# Altium project EVMOMAPL137_Orcad_revg.PrjPcb (part 4 of 4)
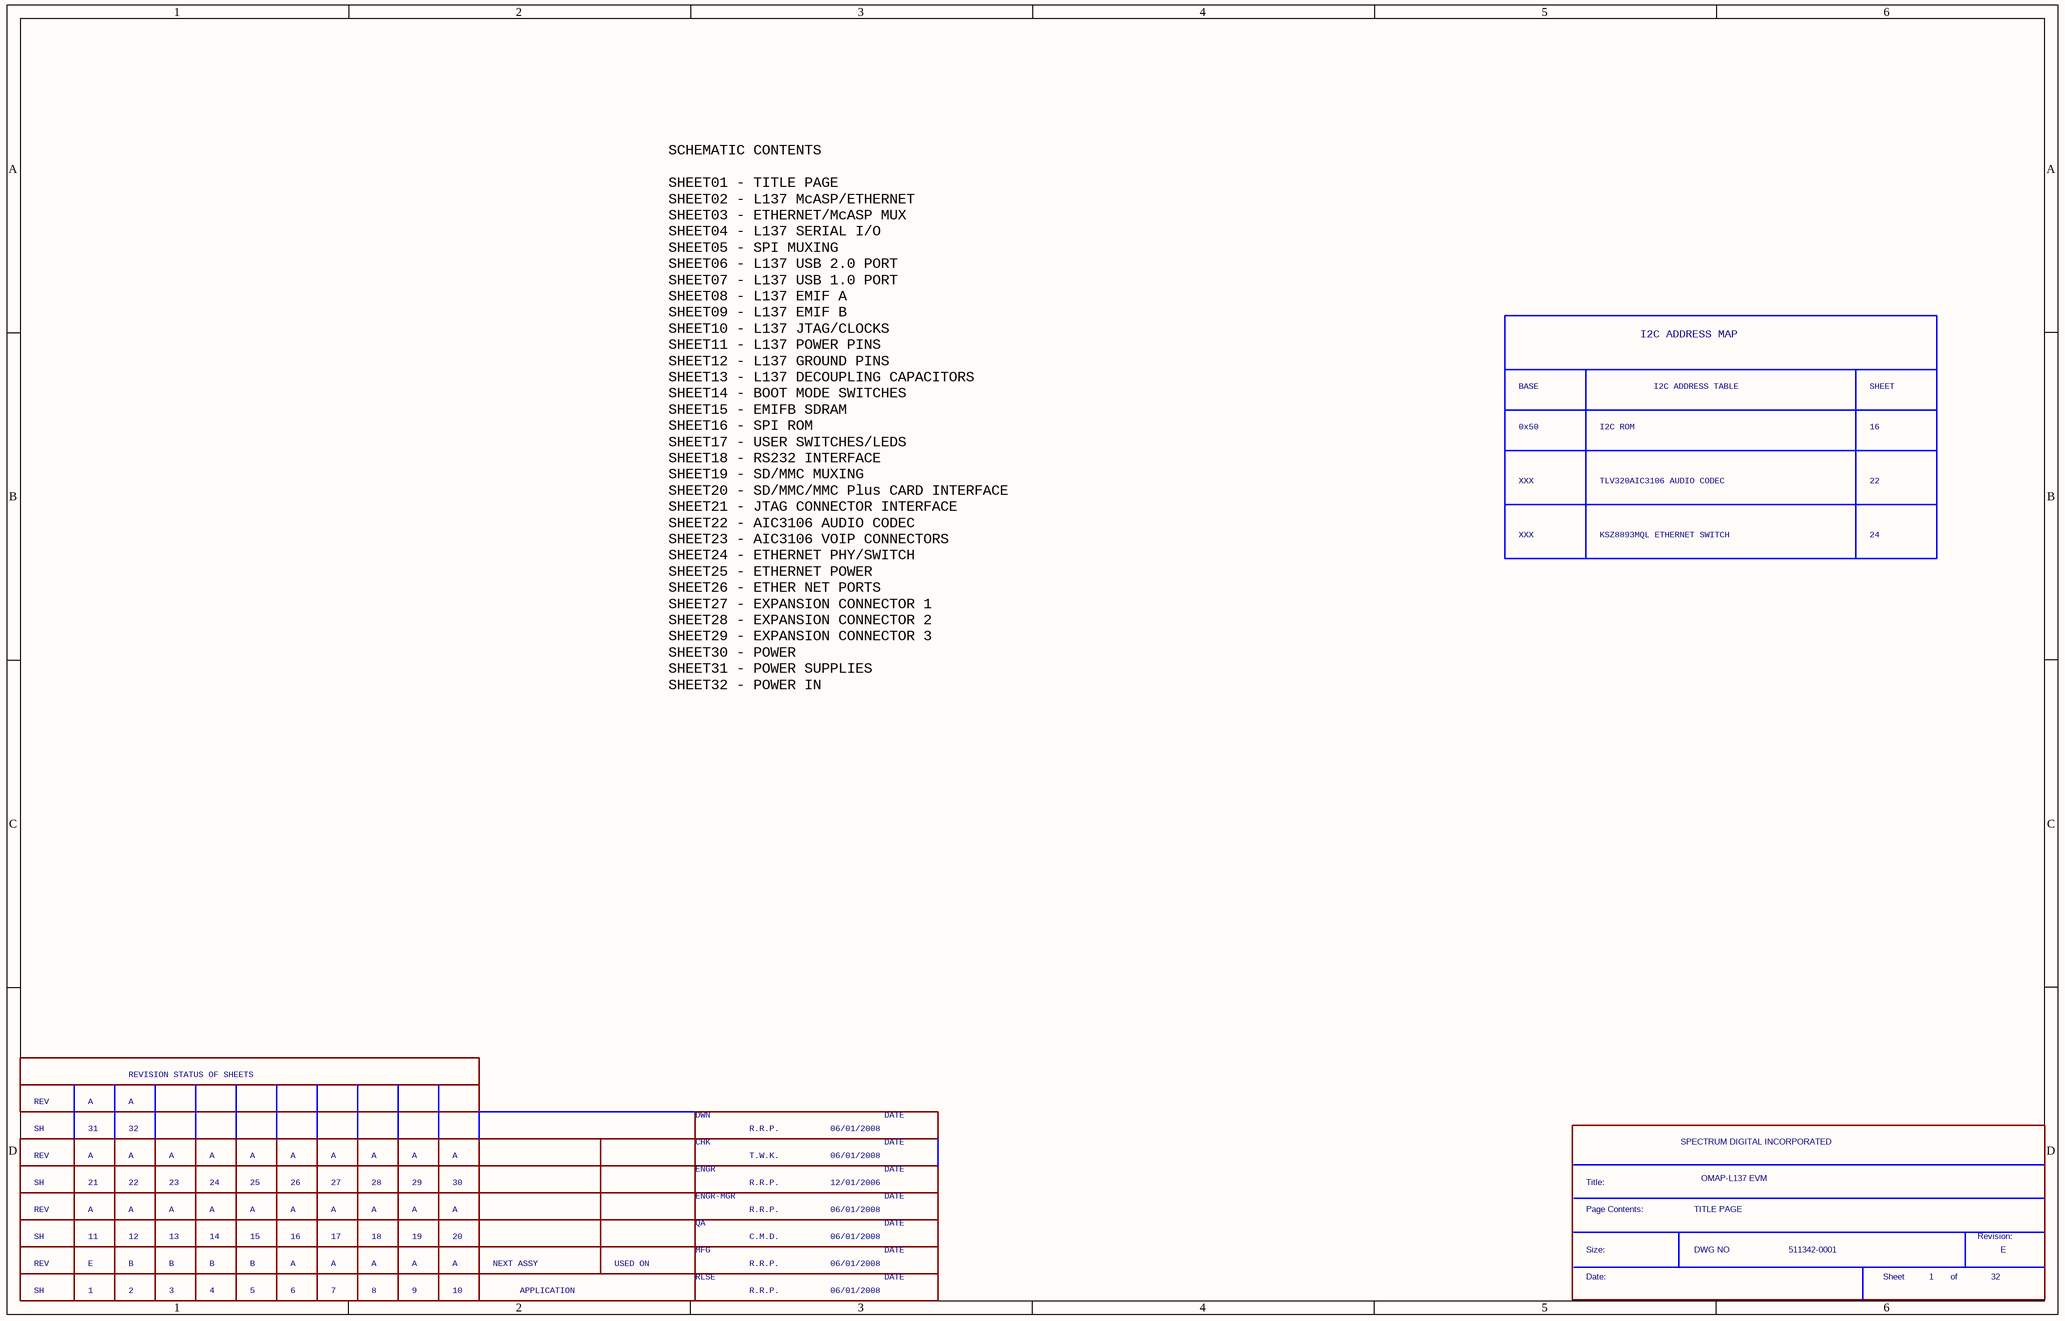
[diagram p32: SH01 - TITLE PAGE.SchDoc]

## Nets that join several sheets
ALT_3V3: SH31 - POWER II (22 pins), SH30 - POWER (6 pins)
ALT_CPU_1V2: SH32 - POWER INPUT (5 pins), SH11 - OMAP-L137 POWER (PTP3.2 PTP4.2 R118.2 R119.1)
CPU_1V2: SH31 - POWER II (R347.1), SH30 - POWER (R313.2 TP20.1), SH11 - OMAP-L137 POWER (7 pins)
CPU_1V8: SH30 - POWER (R323.2 TP26.1), SH07 - OMAP-L137 USB1 (PTP10.2 R64.2), SH06 - OMAP-L137 USB2 (PTP8.2 R57.2)
CPU_3V3: SH30 - POWER (R316.2 TP22.1), SH11 - OMAP-L137 POWER (PTP1.2 R115.2), SH07 - OMAP-L137 USB1 (PTP9.2 R63.2), SH06 - OMAP-L137 USB2 (PTP7.2 R55.2)
CPU_RTC_1V8: SH30 - POWER (C242.1 TP28.1 U44.20), SH10 - OMAP-L137 JTAG (R100.1)
CVDD: SH13 - OMAP-L137 CAPS (19 pins), SH11 - OMAP-L137 POWER (20 pins)
DSK_1V8: SH31 - POWER II (R350.1), SH30 - POWER (R318.2 TP24.1)
DSK_3V3: SH31 - POWER II (R355.1), SH30 - POWER (R312.2 TP18.1), SH27 - EXPANSION1 (C233.1 U43.5), SH26 - ENET PORTS (P9.9 P9.11 P10.9 P10.11), SH25 - ENET- POWER (9 pins), SH24 - ENET PHY (25 pins), SH22 - AIC3106 (13 pins), SH21 - JTAG CONNECTOR (19 pins), SH20 - SD_MMC (18 pins), SH19 - SD_MMC MUX (7 pins), SH18 -  RS232 (5 pins), SH17 - USER SWITCHES_LE (8 pins), SH16 - SPI ROM (19 pins), SH15 - SDRAM EMIF B (32 pins), SH14 - BOOT MODE (15 pins), SH10 - OMAP-L137 JTAG (5 pins), SH09 - OMAP-L137 EMIF B (10 pins), SH08 - OMAP-L137 EMIF A (C39.1 R65.1 U15.5), SH07 - OMAP-L137 USB1 (R61.1), SH06 - OMAP-L137 USB2 (5 pins), SH04 - OMAP-L137 SERIAL (9 pins), SH03 - ETHERNET MUXES (7 pins), SH02 - OMAP-L137 MCASP (8 pins)
DVDD: SH13 - OMAP-L137 CAPS (26 pins), SH11 - OMAP-L137 POWER (23 pins)
ENET_VDDATR: SH26 - ENET PORTS (6 pins), SH25 - ENET- POWER (6 pins)
GND: SH32 - POWER INPUT (18 pins), SH31 - POWER II (26 pins), SH30 - POWER (32 pins), SH29 - EXPANSION3 (23 pins), SH28 - EXPANSION2 (10 pins), SH27 - EXPANSION1 (26 pins), SH26 - ENET PORTS (8 pins), SH25 - ENET- POWER (47 pins), SH24 - ENET PHY (28 pins), SH23 - AIC PHONE AIC (13 pins), SH22 - AIC3106 (45 pins), SH21 - JTAG CONNECTOR (33 pins), SH20 - SD_MMC (13 pins), SH19 - SD_MMC MUX (13 pins), SH18 -  RS232 (9 pins), SH17 - USER SWITCHES_LE (RN24.1 RN24.2 RN24.3 RN24.4), SH16 - SPI ROM (15 pins), SH15 - SDRAM EMIF B (32 pins), SH14 - BOOT MODE (9 pins), SH13 - OMAP-L137 CAPS (45 pins), SH12 - OMAP-L137 GND (32 pins), SH11 - OMAP-L137 POWER (7 pins), SH10 - OMAP-L137 JTAG (15 pins), SH08 - OMAP-L137 EMIF A (28 pins), SH07 - OMAP-L137 USB1 (23 pins), SH06 - OMAP-L137 USB2 (31 pins), SH05 - SPI MUXING (8 pins), SH04 - OMAP-L137 SERIAL (13 pins), SH03 - ETHERNET MUXES (15 pins), SH02 - OMAP-L137 MCASP (14 pins)
VCC_1V2: SH32 - POWER INPUT (R369.1), SH30 - POWER (5 pins)
VCC_1V8: SH32 - POWER INPUT (R371.1), SH30 - POWER (7 pins), SH22 - AIC3106 (L8.2)
VCC_3V3: SH32 - POWER INPUT (R374.1), SH30 - POWER (8 pins), SH08 - OMAP-L137 EMIF A (10 pins), SH05 - SPI MUXING (C11.1 C12.1 U11.16), SH04 - OMAP-L137 SERIAL (C9.1 C10.1 U9.16 U10.16), SH02 - OMAP-L137 MCASP (C1.1 U2.16)
VCC_5V: SH32 - POWER INPUT (7 pins), SH30 - POWER (18 pins), SH29 - EXPANSION3 (8 pins), SH28 - EXPANSION2 (8 pins), SH27 - EXPANSION1 (8 pins), SH23 - AIC PHONE AIC (R212.2), SH07 - OMAP-L137 USB1 (5 pins), SH06 - OMAP-L137 USB2 (5 pins)
VLDO2: SH32 - POWER INPUT (C260.1 U54.1 U54.3), SH30 - POWER (C243.1 L15.2 TP29.1 U44.18)
AHCLKR2: SH27 - EXPANSION1 (P11.40), SH08 - OMAP-L137 EMIF A (U19.5)
AIC3106_RESETn: SH31 - POWER II (R352.1), SH22 - AIC3106 (U38.33)
ARM_RSTn: SH31 - POWER II (U46.1), SH21 - JTAG CONNECTOR (J5.15 R179.1)
B_RMII_CRS_DV: SH24 - ENET PHY (R241.1), SH03 - ETHERNET MUXES (U8.43)
B_RMII_MDIO_CLK: SH24 - ENET PHY (U41.94), SH03 - ETHERNET MUXES (U8.30)
B_RMII_MDIO_D: SH24 - ENET PHY (R236.2 U41.95), SH03 - ETHERNET MUXES (U8.32)
B_RMII_MHZ_50: SH24 - ENET PHY (R237.1), SH03 - ETHERNET MUXES (U8.54)
B_RMII_RXD[0]: SH24 - ENET PHY (R242.1), SH03 - ETHERNET MUXES (U8.41)
B_RMII_RXD[1]: SH24 - ENET PHY (R243.1), SH03 - ETHERNET MUXES (U8.39)
B_RMII_TXD[0]: SH24 - ENET PHY (U41.75), SH03 - ETHERNET MUXES (U8.50)
B_RMII_TXD[1]: SH24 - ENET PHY (U41.74), SH03 - ETHERNET MUXES (U8.47)
B_RMII_TXEN: SH24 - ENET PHY (U41.71), SH03 - ETHERNET MUXES (U8.45)
BOOT_DISABLE: SH31 - POWER II (U52.4 U53.2), SH19 - SD_MMC MUX (U29.1), SH16 - SPI ROM (U26.2), SH14 - BOOT MODE (U61.1), SH03 - ETHERNET MUXES (U6.1), SH02 - OMAP-L137 MCASP (U5.2)
BOOT_DISABLEn: SH31 - POWER II (TP48.1 U53.4), SH27 - EXPANSION1 (U43.1), SH19 - SD_MMC MUX (U30.2), SH16 - SPI ROM (U25.1), SH08 - OMAP-L137 EMIF A (U15.1), SH05 - SPI MUXING (U11.15 U12.2 U12.14), SH04 - OMAP-L137 SERIAL (U9.15 U10.15), SH03 - ETHERNET MUXES (U7.2), SH02 - OMAP-L137 MCASP (U2.15 U4.1)
BOOTMODE[0]: SH16 - SPI ROM (U24.4 U24.21), SH14 - BOOT MODE (R130.1 SW2.9), SH04 - OMAP-L137 SERIAL (RN7.7)
BOOTMODE[1]: SH16 - SPI ROM (U24.7 U24.18), SH14 - BOOT MODE (R129.1 SW2.10), SH04 - OMAP-L137 SERIAL (RN7.8)
BOOTMODE[2]: SH16 - SPI ROM (U24.3 U24.22), SH14 - BOOT MODE (R128.1 SW2.11), SH04 - OMAP-L137 SERIAL (RN7.5)
BOOTMODE[3]: SH16 - SPI ROM (U24.11 U24.14), SH14 - BOOT MODE (U60.4), SH04 - OMAP-L137 SERIAL (RN7.6)
BOOTMODE[7]: SH14 - BOOT MODE (R127.1 SW2.12), SH05 - SPI MUXING (U11.4), SH04 - OMAP-L137 SERIAL (RN8.5)
CPU_RESET: SH31 - POWER II (R363.2 TP47.1 U47.4), SH14 - BOOT MODE (U61.2), SH10 - OMAP-L137 JTAG (R101.2 R102.1 U1.G3)
DSP_EMU0: SH21 - JTAG CONNECTOR (U36.4), SH10 - OMAP-L137 JTAG (SW1.5 U1.J5)
DSP_EMU1: SH21 - JTAG CONNECTOR (U36.9), SH10 - OMAP-L137 JTAG (SW1.2)
DSP_RTCK: SH21 - JTAG CONNECTOR (U36.12), SH10 - OMAP-L137 JTAG (R112.1)
DSP_TCK: SH21 - JTAG CONNECTOR (R171.1), SH10 - OMAP-L137 JTAG (R107.1 U1.H3)
DSP_TDI: SH21 - JTAG CONNECTOR (U34.4), SH10 - OMAP-L137 JTAG (U1.J2)
DSP_TDO: SH21 - JTAG CONNECTOR (U36.7), SH10 - OMAP-L137 JTAG (U1.J3)
DSP_TMS: SH21 - JTAG CONNECTOR (U34.7), SH10 - OMAP-L137 JTAG (U1.J1)
DSP_TRST#: SH21 - JTAG CONNECTOR (U34.12), SH10 - OMAP-L137 JTAG (U1.J4)
EMIFA_A0: SH29 - EXPANSION3 (P13.55), SH08 - OMAP-L137 EMIF A (RN9.11)
EMIFA_A1: SH19 - SD_MMC MUX (U31.21), SH08 - OMAP-L137 EMIF A (RN9.12)
EMIFA_A2: SH19 - SD_MMC MUX (U31.23), SH08 - OMAP-L137 EMIF A (RN9.13)
EMIFA_A3: SH29 - EXPANSION3 (P13.62), SH08 - OMAP-L137 EMIF A (RN9.14)
EMIFA_A4: SH29 - EXPANSION3 (P13.59), SH08 - OMAP-L137 EMIF A (RN9.15)
EMIFA_A5: SH29 - EXPANSION3 (P13.64), SH08 - OMAP-L137 EMIF A (RN9.16)
EMIFA_A6: SH29 - EXPANSION3 (P13.61), SH08 - OMAP-L137 EMIF A (RN11.9)
EMIFA_A7: SH29 - EXPANSION3 (P13.66), SH08 - OMAP-L137 EMIF A (RN11.10)
EMIFA_A8: SH29 - EXPANSION3 (P13.63), SH08 - OMAP-L137 EMIF A (RN11.11)
EMIFA_A9: SH29 - EXPANSION3 (P13.68), SH08 - OMAP-L137 EMIF A (RN11.12)
EMIFA_A10: SH29 - EXPANSION3 (P13.65), SH08 - OMAP-L137 EMIF A (RN11.13)
EMIFA_A11: SH29 - EXPANSION3 (P13.70), SH08 - OMAP-L137 EMIF A (RN11.14)
EMIFA_A12: SH29 - EXPANSION3 (P13.67), SH08 - OMAP-L137 EMIF A (RN11.15)
EMIFA_BA0: SH29 - EXPANSION3 (P13.56), SH08 - OMAP-L137 EMIF A (RN9.9)
EMIFA_BA1: SH29 - EXPANSION3 (P13.58), SH08 - OMAP-L137 EMIF A (RN9.10)
EMIFA_CS2n: SH29 - EXPANSION3 (P13.49), SH08 - OMAP-L137 EMIF A (U15.4)
EMIFA_CS4n: SH19 - SD_MMC MUX (U31.25), SH08 - OMAP-L137 EMIF A (R76.2)
EMIFA_CS5n: SH19 - SD_MMC MUX (U31.27), SH08 - OMAP-L137 EMIF A (R77.2)
EMIFA_D0: SH19 - SD_MMC MUX (U31.2), SH08 - OMAP-L137 EMIF A (R67.2 R68.2 RN10.1)
EMIFA_D1: SH19 - SD_MMC MUX (U31.4), SH08 - OMAP-L137 EMIF A (RN10.2)
EMIFA_D2: SH19 - SD_MMC MUX (U31.6), SH08 - OMAP-L137 EMIF A (RN10.3)
EMIFA_D3: SH19 - SD_MMC MUX (U31.9), SH08 - OMAP-L137 EMIF A (RN10.4)
EMIFA_D4: SH19 - SD_MMC MUX (U31.11), SH08 - OMAP-L137 EMIF A (RN10.5)
EMIFA_D5: SH19 - SD_MMC MUX (U31.13), SH08 - OMAP-L137 EMIF A (RN10.6)
EMIFA_D6: SH19 - SD_MMC MUX (U31.15), SH08 - OMAP-L137 EMIF A (RN10.7)
EMIFA_D7: SH19 - SD_MMC MUX (U31.18), SH08 - OMAP-L137 EMIF A (R70.1 R71.1 RN10.8)
EMIFA_SDCKE: SH29 - EXPANSION3 (P13.37), SH08 - OMAP-L137 EMIF A (R79.2)
EMIFA_WAIT0: SH29 - EXPANSION3 (P13.50), SH08 - OMAP-L137 EMIF A (R65.2 R66.2)
EMIFB_A0: SH15 - SDRAM EMIF B (U21.H7 U22.H7), SH09 - OMAP-L137 EMIF B (RN14.6)
EMIFB_A1: SH15 - SDRAM EMIF B (U21.H8 U22.H8), SH09 - OMAP-L137 EMIF B (RN14.5)
EMIFB_A2: SH15 - SDRAM EMIF B (U21.J8 U22.J8), SH09 - OMAP-L137 EMIF B (RN14.4)
EMIFB_A3: SH15 - SDRAM EMIF B (U21.J7 U22.J7), SH09 - OMAP-L137 EMIF B (RN14.3)
EMIFB_A4: SH15 - SDRAM EMIF B (U21.J3 U22.J3), SH09 - OMAP-L137 EMIF B (RN14.7)
EMIFB_A5: SH15 - SDRAM EMIF B (U21.J2 U22.J2), SH09 - OMAP-L137 EMIF B (RN14.8)
EMIFB_A6: SH15 - SDRAM EMIF B (U21.H3 U22.H3), SH09 - OMAP-L137 EMIF B (RN16.3)
EMIFB_A7: SH15 - SDRAM EMIF B (U21.H2 U22.H2), SH09 - OMAP-L137 EMIF B (RN16.2)
EMIFB_A8: SH15 - SDRAM EMIF B (U21.H1 U22.H1), SH09 - OMAP-L137 EMIF B (RN16.7)
EMIFB_A9: SH15 - SDRAM EMIF B (U21.G3 U22.G3), SH09 - OMAP-L137 EMIF B (RN16.6)
EMIFB_A10: SH15 - SDRAM EMIF B (U21.H9 U22.H9), SH09 - OMAP-L137 EMIF B (RN16.1)
EMIFB_A11: SH15 - SDRAM EMIF B (U21.G2 U22.G2), SH09 - OMAP-L137 EMIF B (RN16.4)
EMIFB_A12: SH15 - SDRAM EMIF B (U21.G1 U22.G1), SH09 - OMAP-L137 EMIF B (RN16.5)
EMIFB_BA0: SH15 - SDRAM EMIF B (U21.G7 U22.G7), SH09 - OMAP-L137 EMIF B (RN14.2)
EMIFB_BA1: SH15 - SDRAM EMIF B (U21.G8 U22.G8), SH09 - OMAP-L137 EMIF B (RN14.1)
EMIFB_CASn: SH15 - SDRAM EMIF B (U21.F7 U22.F7), SH09 - OMAP-L137 EMIF B (R93.1 R624.2)
EMIFB_CLK: SH15 - SDRAM EMIF B (U21.F2 U22.F2), SH09 - OMAP-L137 EMIF B (R91.1 R622.2 TP3.1)
EMIFB_CS0n: SH15 - SDRAM EMIF B (U21.G9 U22.G9), SH09 - OMAP-L137 EMIF B (R92.1 R623.2)
EMIFB_D0: SH15 - SDRAM EMIF B (RN21.9), SH09 - OMAP-L137 EMIF B (RN13.1)
EMIFB_D1: SH15 - SDRAM EMIF B (RN21.10), SH09 - OMAP-L137 EMIF B (RN13.2)
EMIFB_D2: SH15 - SDRAM EMIF B (RN21.11), SH09 - OMAP-L137 EMIF B (RN13.3)
EMIFB_D3: SH15 - SDRAM EMIF B (RN21.12), SH09 - OMAP-L137 EMIF B (RN13.4)
EMIFB_D4: SH15 - SDRAM EMIF B (RN21.13), SH09 - OMAP-L137 EMIF B (RN13.5)
EMIFB_D5: SH15 - SDRAM EMIF B (RN21.14), SH09 - OMAP-L137 EMIF B (RN13.6)
EMIFB_D6: SH15 - SDRAM EMIF B (RN21.15), SH09 - OMAP-L137 EMIF B (RN13.7)
EMIFB_D7: SH15 - SDRAM EMIF B (RN21.16), SH09 - OMAP-L137 EMIF B (RN13.8)
EMIFB_D8: SH15 - SDRAM EMIF B (RN19.9), SH09 - OMAP-L137 EMIF B (RN15.1)
EMIFB_D9: SH15 - SDRAM EMIF B (RN19.10), SH09 - OMAP-L137 EMIF B (RN15.2)
EMIFB_D10: SH15 - SDRAM EMIF B (RN19.11), SH09 - OMAP-L137 EMIF B (RN15.3)
EMIFB_D11: SH15 - SDRAM EMIF B (RN19.12), SH09 - OMAP-L137 EMIF B (RN15.4)
EMIFB_D12: SH15 - SDRAM EMIF B (RN19.13), SH09 - OMAP-L137 EMIF B (RN15.5)
EMIFB_D13: SH15 - SDRAM EMIF B (RN19.14), SH09 - OMAP-L137 EMIF B (RN15.6)
EMIFB_D14: SH15 - SDRAM EMIF B (RN19.15), SH09 - OMAP-L137 EMIF B (RN15.7)
EMIFB_D15: SH15 - SDRAM EMIF B (RN19.16), SH09 - OMAP-L137 EMIF B (RN15.8)
EMIFB_D16: SH15 - SDRAM EMIF B (RN22.9), SH09 - OMAP-L137 EMIF B (RN17.1)
EMIFB_D17: SH15 - SDRAM EMIF B (RN22.11), SH09 - OMAP-L137 EMIF B (RN17.2)
EMIFB_D18: SH15 - SDRAM EMIF B (RN22.10), SH09 - OMAP-L137 EMIF B (RN17.3)
EMIFB_D19: SH15 - SDRAM EMIF B (RN22.13), SH09 - OMAP-L137 EMIF B (RN17.4)
EMIFB_D20: SH15 - SDRAM EMIF B (RN22.12), SH09 - OMAP-L137 EMIF B (RN17.5)
EMIFB_D21: SH15 - SDRAM EMIF B (RN22.15), SH09 - OMAP-L137 EMIF B (RN17.6)
EMIFB_D22: SH15 - SDRAM EMIF B (RN22.14), SH09 - OMAP-L137 EMIF B (RN17.7)
EMIFB_D23: SH15 - SDRAM EMIF B (RN22.16), SH09 - OMAP-L137 EMIF B (RN17.8)
EMIFB_D24: SH15 - SDRAM EMIF B (RN20.9), SH09 - OMAP-L137 EMIF B (RN18.1)
EMIFB_D25: SH15 - SDRAM EMIF B (RN20.10), SH09 - OMAP-L137 EMIF B (RN18.2)
EMIFB_D26: SH15 - SDRAM EMIF B (RN20.11), SH09 - OMAP-L137 EMIF B (RN18.3)
EMIFB_D27: SH15 - SDRAM EMIF B (RN20.12), SH09 - OMAP-L137 EMIF B (RN18.4)
EMIFB_D28: SH15 - SDRAM EMIF B (RN20.13), SH09 - OMAP-L137 EMIF B (RN18.5)
EMIFB_D29: SH15 - SDRAM EMIF B (RN20.14), SH09 - OMAP-L137 EMIF B (RN18.6)
EMIFB_D30: SH15 - SDRAM EMIF B (RN20.15), SH09 - OMAP-L137 EMIF B (RN18.7)
EMIFB_D31: SH15 - SDRAM EMIF B (RN20.16), SH09 - OMAP-L137 EMIF B (RN18.8)
EMIFB_RASn: SH15 - SDRAM EMIF B (U21.F8 U22.F8), SH09 - OMAP-L137 EMIF B (R94.1 R625.2)
EMIFB_SDCKE: SH15 - SDRAM EMIF B (U21.F3 U22.F3), SH09 - OMAP-L137 EMIF B (R90.1 R621.2)
EMIFB_WEn: SH15 - SDRAM EMIF B (U21.F9 U22.F9), SH09 - OMAP-L137 EMIF B (R99.1 R630.2)
EMIFB_WEn_DQM0: SH15 - SDRAM EMIF B (U21.E8), SH09 - OMAP-L137 EMIF B (R95.1 R626.2)
EMIFB_WEn_DQM1: SH15 - SDRAM EMIF B (U21.F1), SH09 - OMAP-L137 EMIF B (R96.1 R627.2)
EMIFB_WEn_DQM2: SH15 - SDRAM EMIF B (U22.E8), SH09 - OMAP-L137 EMIF B (R97.1 R628.2)
EMIFB_WEn_DQM3: SH15 - SDRAM EMIF B (U22.F1), SH09 - OMAP-L137 EMIF B (R98.1 R629.2)
ENABLE_1V2: SH31 - POWER II (R359.2 R360.2), SH30 - POWER (C269.1 R329.2 U44.25)
ENABLE_1V8: SH31 - POWER II (R361.2 R362.2), SH30 - POWER (C268.1 R328.2 U44.24)
ENABLE_3V3: SH31 - POWER II (R364.2 R365.2), SH30 - POWER (C267.1 R327.2 U44.23)
ENET_RESET: SH31 - POWER II (R354.1), SH24 - ENET PHY (U41.67)
EQEP0A: SH28 - EXPANSION2 (P12.13), SH16 - SPI ROM (U24.15)
EQEP0B: SH28 - EXPANSION2 (P12.15), SH16 - SPI ROM (U24.16)
EXP1_AMUTE2: SH27 - EXPANSION1 (P11.39), SH08 - OMAP-L137 EMIF A (U58.2)
EXP1_AXR0_12: SH27 - EXPANSION1 (P11.27), SH08 - OMAP-L137 EMIF A (U17.11)
EXP1_AXR0_13: SH27 - EXPANSION1 (P11.29), SH08 - OMAP-L137 EMIF A (U17.14)
EXP1_AXR0_14: SH27 - EXPANSION1 (P11.31), SH08 - OMAP-L137 EMIF A (U17.5)
EXP1_AXR0_15: SH27 - EXPANSION1 (P11.33), SH08 - OMAP-L137 EMIF A (U17.2)
EXP1_SEL_MCASP1: SH27 - EXPANSION1 (P11.74), SH02 - OMAP-L137 MCASP (R19.1 U4.2 U5.1)
EXP1_SPI1_CLK: SH27 - EXPANSION1 (P11.44), SH05 - SPI MUXING (U11.2)
EXP1_SPI1_ENAn: SH27 - EXPANSION1 (P11.41), SH05 - SPI MUXING (U12.11)
EXP1_SPI1_SCSn: SH27 - EXPANSION1 (P11.42), SH05 - SPI MUXING (U12.5)
EXP1_SPI1_SIMO: SH27 - EXPANSION1 (P11.43), SH05 - SPI MUXING (U11.5)
EXP2.SPI0_CLK: SH28 - EXPANSION2 (P12.11), SH16 - SPI ROM (U24.23)
EXP2.SPI0_SIMO: SH28 - EXPANSION2 (P12.9), SH16 - SPI ROM (U24.19)
EXP2.SPI0_SOMI: SH28 - EXPANSION2 (P12.7), SH16 - SPI ROM (U24.20)
EXP2_SPI1_CLK: SH28 - EXPANSION2 (P12.12), SH05 - SPI MUXING (U11.3)
EXP2_SPI1_ENAn: SH28 - EXPANSION2 (P12.16), SH05 - SPI MUXING (U12.12 U12.13)
EXP2_SPI1_SCSn: SH28 - EXPANSION2 (P12.14), SH05 - SPI MUXING (U12.3 U12.4)
EXP2_SPI1_SIMO: SH28 - EXPANSION2 (P12.10), SH05 - SPI MUXING (U11.6)
EXP2_SPI1_SOMI: SH28 - EXPANSION2 (P12.8), SH05 - SPI MUXING (U11.10)
EXP2_TMP64P0_IN12: SH28 - EXPANSION2 (P12.29), SH04 - OMAP-L137 SERIAL (R41.2 U10.6)
EXP2_TMP64P0_OUT12: SH28 - EXPANSION2 (P12.27), SH04 - OMAP-L137 SERIAL (R43.2 U10.3)
EXP2_UART1_RXD: SH28 - EXPANSION2 (P12.28), SH04 - OMAP-L137 SERIAL (U9.3)
EXP2_UART1_TXD: SH28 - EXPANSION2 (P12.30), SH04 - OMAP-L137 SERIAL (U9.6)
EXP3_EMIFA_CLK: SH29 - EXPANSION3 (P13.38), SH08 - OMAP-L137 EMIF A (U19.3)
EXP3_EMIFA_CS3n: SH29 - EXPANSION3 (P13.51), SH08 - OMAP-L137 EMIF A (U58.3)
EXP3_EMIFA_OEn: SH29 - EXPANSION3 (P13.44), SH08 - OMAP-L137 EMIF A (U17.13)
EXP3_EMIFA_WEn: SH29 - EXPANSION3 (P13.46), SH08 - OMAP-L137 EMIF A (U17.10)
EXP3_EMIFA_WEn_DQM0: SH29 - EXPANSION3 (P13.31), SH08 - OMAP-L137 EMIF A (U17.3)
EXP3_EMIFA_WEn_DQM1: SH29 - EXPANSION3 (P13.33), SH08 - OMAP-L137 EMIF A (U17.6)
EXP3_SEL_MEM: SH29 - EXPANSION3 (P13.8), SH08 - OMAP-L137 EMIF A (R84.1 U17.1)
EXP3_SEL_MEM_CTL: SH29 - EXPANSION3 (P13.7), SH08 - OMAP-L137 EMIF A (U58.1)
EXP3_SEL_MEM_CTL2: SH29 - EXPANSION3 (P13.73), SH08 - OMAP-L137 EMIF A (R89.1 U19.2)
EXP3_SEL_MEMD0_7: SH29 - EXPANSION3 (P13.6), SH19 - SD_MMC MUX (R151.1 U29.2 U30.1)
EXP3_SEL_MEMD8_D11: SH29 - EXPANSION3 (P13.32), SH14 - BOOT MODE (SW5.8), SH08 - OMAP-L137 EMIF A (R83.1 U16.1)
EXP3_SEL_MEMD12_D15: SH29 - EXPANSION3 (P13.34), SH14 - BOOT MODE (SW5.7), SH08 - OMAP-L137 EMIF A (R88.1 U18.1)
EXP_ACLKX1: SH27 - EXPANSION1 (P11.58), SH02 - OMAP-L137 MCASP (U3.15)
EXP_AFSX1: SH27 - EXPANSION1 (P11.54), SH02 - OMAP-L137 MCASP (U3.20)
EXP_AHCLKR0: SH27 - EXPANSION1 (P11.9), SH03 - ETHERNET MUXES (U8.53)
EXP_AHCLKX1: SH27 - EXPANSION1 (P11.49), SH02 - OMAP-L137 MCASP (U3.23)
EXP_AXR0[0]: SH27 - EXPANSION1 (P11.22), SH03 - ETHERNET MUXES (U8.48)
EXP_AXR0[1]: SH27 - EXPANSION1 (P11.24), SH03 - ETHERNET MUXES (U8.46)
EXP_AXR0[2]: SH27 - EXPANSION1 (P11.26), SH03 - ETHERNET MUXES (U8.44)
EXP_AXR0[3]: SH27 - EXPANSION1 (P11.28), SH03 - ETHERNET MUXES (U8.42)
EXP_AXR0[4]: SH27 - EXPANSION1 (P11.30), SH03 - ETHERNET MUXES (U8.40)
EXP_AXR0[5]: SH27 - EXPANSION1 (P11.32), SH03 - ETHERNET MUXES (U8.37)
EXP_AXR0[6]: SH27 - EXPANSION1 (P11.34), SH03 - ETHERNET MUXES (U8.35)
EXP_AXR0[7]: SH27 - EXPANSION1 (P11.36), SH03 - ETHERNET MUXES (U8.29)
EXP_AXR0[8]: SH27 - EXPANSION1 (P11.21), SH03 - ETHERNET MUXES (U8.31)
EXP_AXR0_9: SH27 - EXPANSION1 (P11.23), SH04 - OMAP-L137 SERIAL (U9.2)
EXP_AXR0_10: SH27 - EXPANSION1 (P11.25), SH04 - OMAP-L137 SERIAL (U9.5)
EXP_AXR1[0]: SH27 - EXPANSION1 (P11.62), SH02 - OMAP-L137 MCASP (U3.19)
EXP_AXR1[3]: SH27 - EXPANSION1 (P11.68), SH02 - OMAP-L137 MCASP (U2.2)
EXP_AXR1[4]: SH27 - EXPANSION1 (P11.70), SH02 - OMAP-L137 MCASP (U2.5)
EXP_AXR1[5]: SH27 - EXPANSION1 (P11.72), SH02 - OMAP-L137 MCASP (U3.16)
EXP_EMIFA_A1: SH29 - EXPANSION3 (P13.60), SH19 - SD_MMC MUX (U31.35)
EXP_EMIFA_A2: SH29 - EXPANSION3 (P13.57), SH19 - SD_MMC MUX (U31.33)
EXP_EMIFA_CS0n: SH29 - EXPANSION3 (P13.52), SH08 - OMAP-L137 EMIF A (U19.13)
EXP_EMIFA_CS4n: SH29 - EXPANSION3 (P13.43), SH19 - SD_MMC MUX (U31.31)
EXP_EMIFA_CS5n: SH29 - EXPANSION3 (P13.45), SH19 - SD_MMC MUX (U31.29)
EXP_EMIFA_D0: SH29 - EXPANSION3 (P13.12), SH19 - SD_MMC MUX (U31.53)
EXP_EMIFA_D1: SH29 - EXPANSION3 (P13.11), SH19 - SD_MMC MUX (U31.51)
EXP_EMIFA_D2: SH29 - EXPANSION3 (P13.14), SH19 - SD_MMC MUX (U31.48)
EXP_EMIFA_D3: SH29 - EXPANSION3 (P13.13), SH19 - SD_MMC MUX (U31.46)
EXP_EMIFA_D4: SH29 - EXPANSION3 (P13.16), SH19 - SD_MMC MUX (U31.44)
EXP_EMIFA_D5: SH29 - EXPANSION3 (P13.15), SH19 - SD_MMC MUX (U31.42)
EXP_EMIFA_D6: SH29 - EXPANSION3 (P13.18), SH19 - SD_MMC MUX (U31.40)
EXP_EMIFA_D7: SH29 - EXPANSION3 (P13.17), SH19 - SD_MMC MUX (U31.37)
EXP_EMIFA_D8: SH29 - EXPANSION3 (P13.22), SH08 - OMAP-L137 EMIF A (U16.3)
EXP_EMIFA_D9: SH29 - EXPANSION3 (P13.21), SH08 - OMAP-L137 EMIF A (U16.6)
EXP_EMIFA_D10: SH29 - EXPANSION3 (P13.24), SH08 - OMAP-L137 EMIF A (U16.10)
EXP_EMIFA_D11: SH29 - EXPANSION3 (P13.23), SH08 - OMAP-L137 EMIF A (U16.13)
EXP_EMIFA_D12: SH29 - EXPANSION3 (P13.26), SH08 - OMAP-L137 EMIF A (U18.3)
EXP_EMIFA_D13: SH29 - EXPANSION3 (P13.25), SH08 - OMAP-L137 EMIF A (U18.6)
EXP_EMIFA_D14: SH29 - EXPANSION3 (P13.28), SH08 - OMAP-L137 EMIF A (U18.10)
EXP_EMIFA_D15: SH29 - EXPANSION3 (P13.27), SH08 - OMAP-L137 EMIF A (U18.13)
EXP_EQEP1A: SH28 - EXPANSION2 (P12.22), SH02 - OMAP-L137 MCASP (U2.3)
EXP_EQEP1B: SH28 - EXPANSION2 (P12.24), SH02 - OMAP-L137 MCASP (U2.6)
EXP_RESETn: SH31 - POWER II (R357.1), SH29 - EXPANSION3 (P13.74), SH28 - EXPANSION2 (P12.36), SH27 - EXPANSION1 (P11.76)
EXP_SPI1_SOMI: SH27 - EXPANSION1 (P11.45), SH05 - SPI MUXING (U11.11)
HANDSET_MIC_N: SH23 - AIC PHONE AIC (C180.1), SH22 - AIC3106 (U38.8)
HANDSET_MIC_P: SH23 - AIC PHONE AIC (C176.1), SH22 - AIC3106 (U38.7)
HANDSET_SPKR_N: SH23 - AIC PHONE AIC (C185.1), SH22 - AIC3106 (U38.22)
HANDSET_SPKR_P: SH23 - AIC PHONE AIC (C186.2), SH22 - AIC3106 (C169.1 U38.23)
HEADSET_MIC_N: SH23 - AIC PHONE AIC (C193.1), SH22 - AIC3106 (U38.10)
HEADSET_MIC_P: SH23 - AIC PHONE AIC (C190.1), SH22 - AIC3106 (U38.9)
HEADSET_SPKR_N: SH23 - AIC PHONE AIC (R231.1), SH22 - AIC3106 (U38.19)
HEADSET_SPKR_P: SH23 - AIC PHONE AIC (R230.1), SH22 - AIC3106 (C168.1 U38.18)
I2C0_SCL: SH30 - POWER (U44.30), SH28 - EXPANSION2 (P12.19), SH27 - EXPANSION1 (P11.7), SH24 - ENET PHY (R333.1), SH22 - AIC3106 (U38.1), SH16 - SPI ROM (U27.6), SH04 - OMAP-L137 SERIAL (R42.2 U10.2)
I2C0_SDA: SH30 - POWER (U44.29), SH28 - EXPANSION2 (P12.21), SH27 - EXPANSION1 (P11.5), SH24 - ENET PHY (R389.1), SH22 - AIC3106 (U38.2), SH16 - SPI ROM (U27.5), SH04 - OMAP-L137 SERIAL (R40.2 U10.5)
MIC_BIAS_HS: SH23 - AIC PHONE AIC (R211.1 R217.1 R225.1 R229.1), SH22 - AIC3106 (R190.1)
MMC_SD_CLK: SH20 - SD_MMC (5 pins), SH19 - SD_MMC MUX (U31.36)
MMC_SD_CMD: SH20 - SD_MMC (5 pins), SH19 - SD_MMC MUX (U31.34)
MMC_SD_DATA0: SH20 - SD_MMC (P2.7 P2.22 R157.2 U32.8), SH19 - SD_MMC MUX (U31.54)
MMC_SD_DATA1: SH20 - SD_MMC (P2.8 P2.23 R158.2 U32.7), SH19 - SD_MMC MUX (U31.52)
MMC_SD_DATA2: SH20 - SD_MMC (P2.9 P2.24 R159.2 U33.2), SH19 - SD_MMC MUX (U31.50)
MMC_SD_DATA3: SH20 - SD_MMC (5 pins), SH19 - SD_MMC MUX (U31.47)
MMC_SD_DATA4: SH20 - SD_MMC (P2.10 R160.2 U33.1), SH19 - SD_MMC MUX (U31.45)
MMC_SD_DATA5: SH20 - SD_MMC (P2.11 R161.2 U33.8), SH19 - SD_MMC MUX (U31.43)
MMC_SD_DATA6: SH20 - SD_MMC (P2.12 R162.2 U33.7), SH19 - SD_MMC MUX (U31.41)
MMC_SD_DATA7: SH20 - SD_MMC (P2.13 R163.2 U33.6), SH19 - SD_MMC MUX (U31.39)
MMC_SD_INS: SH20 - SD_MMC (P2.15 R167.1), SH19 - SD_MMC MUX (U31.30)
MMC_SD_WP: SH20 - SD_MMC (P2.14 R168.1), SH19 - SD_MMC MUX (U31.32)
ON_BD_OFF_BD: SH14 - BOOT MODE (SW5.9), SH08 - OMAP-L137 EMIF A (R384.1 U19.14), SH06 - OMAP-L137 USB2 (U59.1)
ON_BD_USB_DRV: SH08 - OMAP-L137 EMIF A (U19.4 U19.6), SH07 - OMAP-L137 USB1 (R62.2 U14.4)
ON_BD_USB_OVC: SH08 - OMAP-L137 EMIF A (U19.10 U19.12), SH07 - OMAP-L137 USB1 (R61.2 TP5.1 U14.5)
P1LED2: SH26 - ENET PORTS (P9.10), SH24 - ENET PHY (R235.1)
P1LED3: SH26 - ENET PORTS (P9.12), SH24 - ENET PHY (R233.2 R234.1)
P2LED2: SH26 - ENET PORTS (P10.10), SH24 - ENET PHY (R240.1)
P2LED3: SH26 - ENET PORTS (P10.12), SH24 - ENET PHY (R239.1)
PB_RESET: SH31 - POWER II (R334.1 U50.3), SH30 - POWER (R345.1 R387.2 SW4.B SW4.B1)
PONRSnIN: SH31 - POWER II (R358.1), SH21 - JTAG CONNECTOR (R178.1)
RXM1: SH26 - ENET PORTS (P9.6 R307.2), SH24 - ENET PHY (U41.46)
RXM2: SH26 - ENET PORTS (P10.6 R311.2), SH24 - ENET PHY (U41.52)
RXP1: SH26 - ENET PORTS (P9.3 R306.2), SH24 - ENET PHY (U41.45)
RXP2: SH26 - ENET PORTS (P10.3 R310.2), SH24 - ENET PHY (U41.53)
SEL_ENETn_MCASP0: SH27 - EXPANSION1 (P11.8), SH14 - BOOT MODE (SW5.12), SH03 - ETHERNET MUXES (R20.1 U6.2 U7.1)
SEL_EXP2_QEP0: SH28 - EXPANSION2 (P12.25), SH16 - SPI ROM (R137.1 U25.2 U26.1)
SEL_EXP2_QEP1: SH28 - EXPANSION2 (P12.26), SH02 - OMAP-L137 MCASP (R18.1 U2.1)
SEL_EXP2_TIMER: SH28 - EXPANSION2 (P12.35), SH14 - BOOT MODE (SW5.11), SH04 - OMAP-L137 SERIAL (R47.1 U10.1)
SEL_EXP2_UART1: SH28 - EXPANSION2 (P12.34), SH14 - BOOT MODE (SW5.10), SH04 - OMAP-L137 SERIAL (R46.1 U9.1)
SEL_SPI1_EXP1: SH27 - EXPANSION1 (P11.73), SH05 - SPI MUXING (R51.1 U12.1)
SEL_SPI1_EXP2: SH28 - EXPANSION2 (P12.20), SH05 - SPI MUXING (R50.1 U12.15)
SEL_SPI1_EXP2_B: SH28 - EXPANSION2 (P12.33), SH05 - SPI MUXING (R49.1 U11.1)
SPI0_SCSn: SH16 - SPI ROM (U24.8 U24.17), SH04 - OMAP-L137 SERIAL (R24.2 R27.1 R28.1)
SPI1_SIMO: SH05 - SPI MUXING (U11.7), SH04 - OMAP-L137 SERIAL (R37.2 R38.1 RN8.8)
SPI1_SOMI: SH05 - SPI MUXING (U11.9), SH04 - OMAP-L137 SERIAL (R35.2 R36.1 RN8.7)
SYS_RESETn: SH31 - POWER II (R388.1), SH30 - POWER (R325.2 U44.27)
T_ACLKR0: SH27 - EXPANSION1 (P11.17), SH02 - OMAP-L137 MCASP (RN2.8)
T_ACLKR1: SH27 - EXPANSION1 (P11.57), SH02 - OMAP-L137 MCASP (RN5.6)
T_ACLKX0: SH27 - EXPANSION1 (P11.18), SH06 - OMAP-L137 USB2 (U59.4), SH02 - OMAP-L137 MCASP (RN2.6)
T_AFSR0: SH27 - EXPANSION1 (P11.13), SH02 - OMAP-L137 MCASP (RN2.7)
T_AFSR1: SH27 - EXPANSION1 (P11.53), SH02 - OMAP-L137 MCASP (RN5.7)
T_AFSX0: SH27 - EXPANSION1 (U43.2), SH02 - OMAP-L137 MCASP (R2.2 R3.1 RN2.5)
T_AHCLKR0/RMII_MHZ_50: SH03 - ETHERNET MUXES (U8.2), SH02 - OMAP-L137 MCASP (R11.1 R13.2 R17.1)
T_AHCLKR1: SH27 - EXPANSION1 (P11.50), SH02 - OMAP-L137 MCASP (RN5.5)
T_AIC_BCLK: SH22 - AIC3106 (R194.1), SH02 - OMAP-L137 MCASP (U3.10)
T_AIC_DIN: SH22 - AIC3106 (R196.1), SH02 - OMAP-L137 MCASP (U3.9)
T_AIC_DOUT: SH22 - AIC3106 (R197.1), SH02 - OMAP-L137 MCASP (U3.6)
T_AIC_MCLK: SH22 - AIC3106 (R210.1), SH02 - OMAP-L137 MCASP (U3.2)
T_AIC_WCLK: SH22 - AIC3106 (R195.1), SH02 - OMAP-L137 MCASP (U3.5)
T_AMUTE0: SH27 - EXPANSION1 (P11.10), SH02 - OMAP-L137 MCASP (R1.1)
T_AMUTE1: SH27 - EXPANSION1 (P11.46), SH02 - OMAP-L137 MCASP (RN6.8)
T_AXR0[0]/RMII_TXD[0]: SH03 - ETHERNET MUXES (U8.6), SH02 - OMAP-L137 MCASP (R9.1)
T_AXR0[1]/RMII_TXD[1]: SH03 - ETHERNET MUXES (U8.9), SH02 - OMAP-L137 MCASP (R10.1)
T_AXR0[2]/RMII_TXEN: SH03 - ETHERNET MUXES (U8.11), SH02 - OMAP-L137 MCASP (R8.1)
T_AXR0[3]/RMII_CRS_DV: SH03 - ETHERNET MUXES (U8.13), SH02 - OMAP-L137 MCASP (R5.1)
T_AXR0[4]/RMII_RXD[0]: SH03 - ETHERNET MUXES (U8.15), SH02 - OMAP-L137 MCASP (R6.1)
T_AXR0[5]/RMII_RXD[1]: SH03 - ETHERNET MUXES (U8.18), SH02 - OMAP-L137 MCASP (R7.1)
T_AXR0[6]/RMII_RXER: SH03 - ETHERNET MUXES (U8.21), SH02 - OMAP-L137 MCASP (R4.1)
T_AXR0[7]/RMII_MDIO_CLK: SH03 - ETHERNET MUXES (U8.27), SH02 - OMAP-L137 MCASP (R14.1)
T_AXR0[8]/RMII_MDIO_D: SH03 - ETHERNET MUXES (U8.25), SH02 - OMAP-L137 MCASP (R12.1)
T_AXR0_11/AXR2_0/GPIO3_11: SH27 - EXPANSION1 (P11.35), SH02 - OMAP-L137 MCASP (R16.1)
T_AXR1[1]: SH27 - EXPANSION1 (P11.64), SH02 - OMAP-L137 MCASP (RN1.6)
T_AXR1[2]: SH27 - EXPANSION1 (P11.66), SH02 - OMAP-L137 MCASP (RN1.7)
T_AXR1[6]: SH27 - EXPANSION1 (P11.61), SH02 - OMAP-L137 MCASP (RN3.7)
T_AXR1[7]: SH27 - EXPANSION1 (P11.63), SH02 - OMAP-L137 MCASP (RN3.8)
T_AXR1[8]: SH27 - EXPANSION1 (P11.65), SH02 - OMAP-L137 MCASP (RN4.5)
T_AXR1[9]: SH27 - EXPANSION1 (P11.67), SH02 - OMAP-L137 MCASP (RN4.6)
T_AXR1[10]: SH27 - EXPANSION1 (P11.69), SH02 - OMAP-L137 MCASP (RN4.7)
T_AXR1[11]: SH27 - EXPANSION1 (P11.71), SH02 - OMAP-L137 MCASP (RN4.8)
T_SPI1_ENAn: SH05 - SPI MUXING (U12.9), SH04 - OMAP-L137 SERIAL (RN8.6)
T_SPI1_SCSn: SH05 - SPI MUXING (U12.7), SH04 - OMAP-L137 SERIAL (R39.1)
TXM1: SH26 - ENET PORTS (P9.2 R304.1), SH24 - ENET PHY (U41.49)
TXM2: SH26 - ENET PORTS (P10.2 R308.1), SH24 - ENET PHY (U41.55)
TXP1: SH26 - ENET PORTS (P9.1 R305.1), SH24 - ENET PHY (U41.48)
TXP2: SH26 - ENET PORTS (P10.1 R309.1), SH24 - ENET PHY (U41.56)
UART2_RXD: SH18 -  RS232 (U28.9), SH05 - SPI MUXING (U12.10)
UART2_TXD: SH18 -  RS232 (U28.11), SH05 - SPI MUXING (U12.6)
USER_LED1: SH17 - USER SWITCHES_LE (DS1.1), SH08 - OMAP-L137 EMIF A (U18.2)
USER_LED2: SH17 - USER SWITCHES_LE (DS2.1), SH08 - OMAP-L137 EMIF A (U18.5)
USER_LED3: SH17 - USER SWITCHES_LE (DS3.1), SH08 - OMAP-L137 EMIF A (U18.11)
USER_LED4: SH17 - USER SWITCHES_LE (DS4.1), SH08 - OMAP-L137 EMIF A (U18.14)
USER_SW1: SH17 - USER SWITCHES_LE (RN23.8 SW3.1), SH08 - OMAP-L137 EMIF A (U16.2)
USER_SW2: SH17 - USER SWITCHES_LE (RN23.7 SW3.2), SH08 - OMAP-L137 EMIF A (U16.5)
USER_SW3: SH17 - USER SWITCHES_LE (RN23.6 SW3.3), SH08 - OMAP-L137 EMIF A (U16.11)
USER_SW4: SH17 - USER SWITCHES_LE (RN23.5 SW3.4), SH08 - OMAP-L137 EMIF A (U16.14)
XRSn: SH31 - POWER II (U46.2), SH21 - JTAG CONNECTOR (R172.2)